# EAGLE design spool_tmc2130_b (EAGLE 9.7.0)
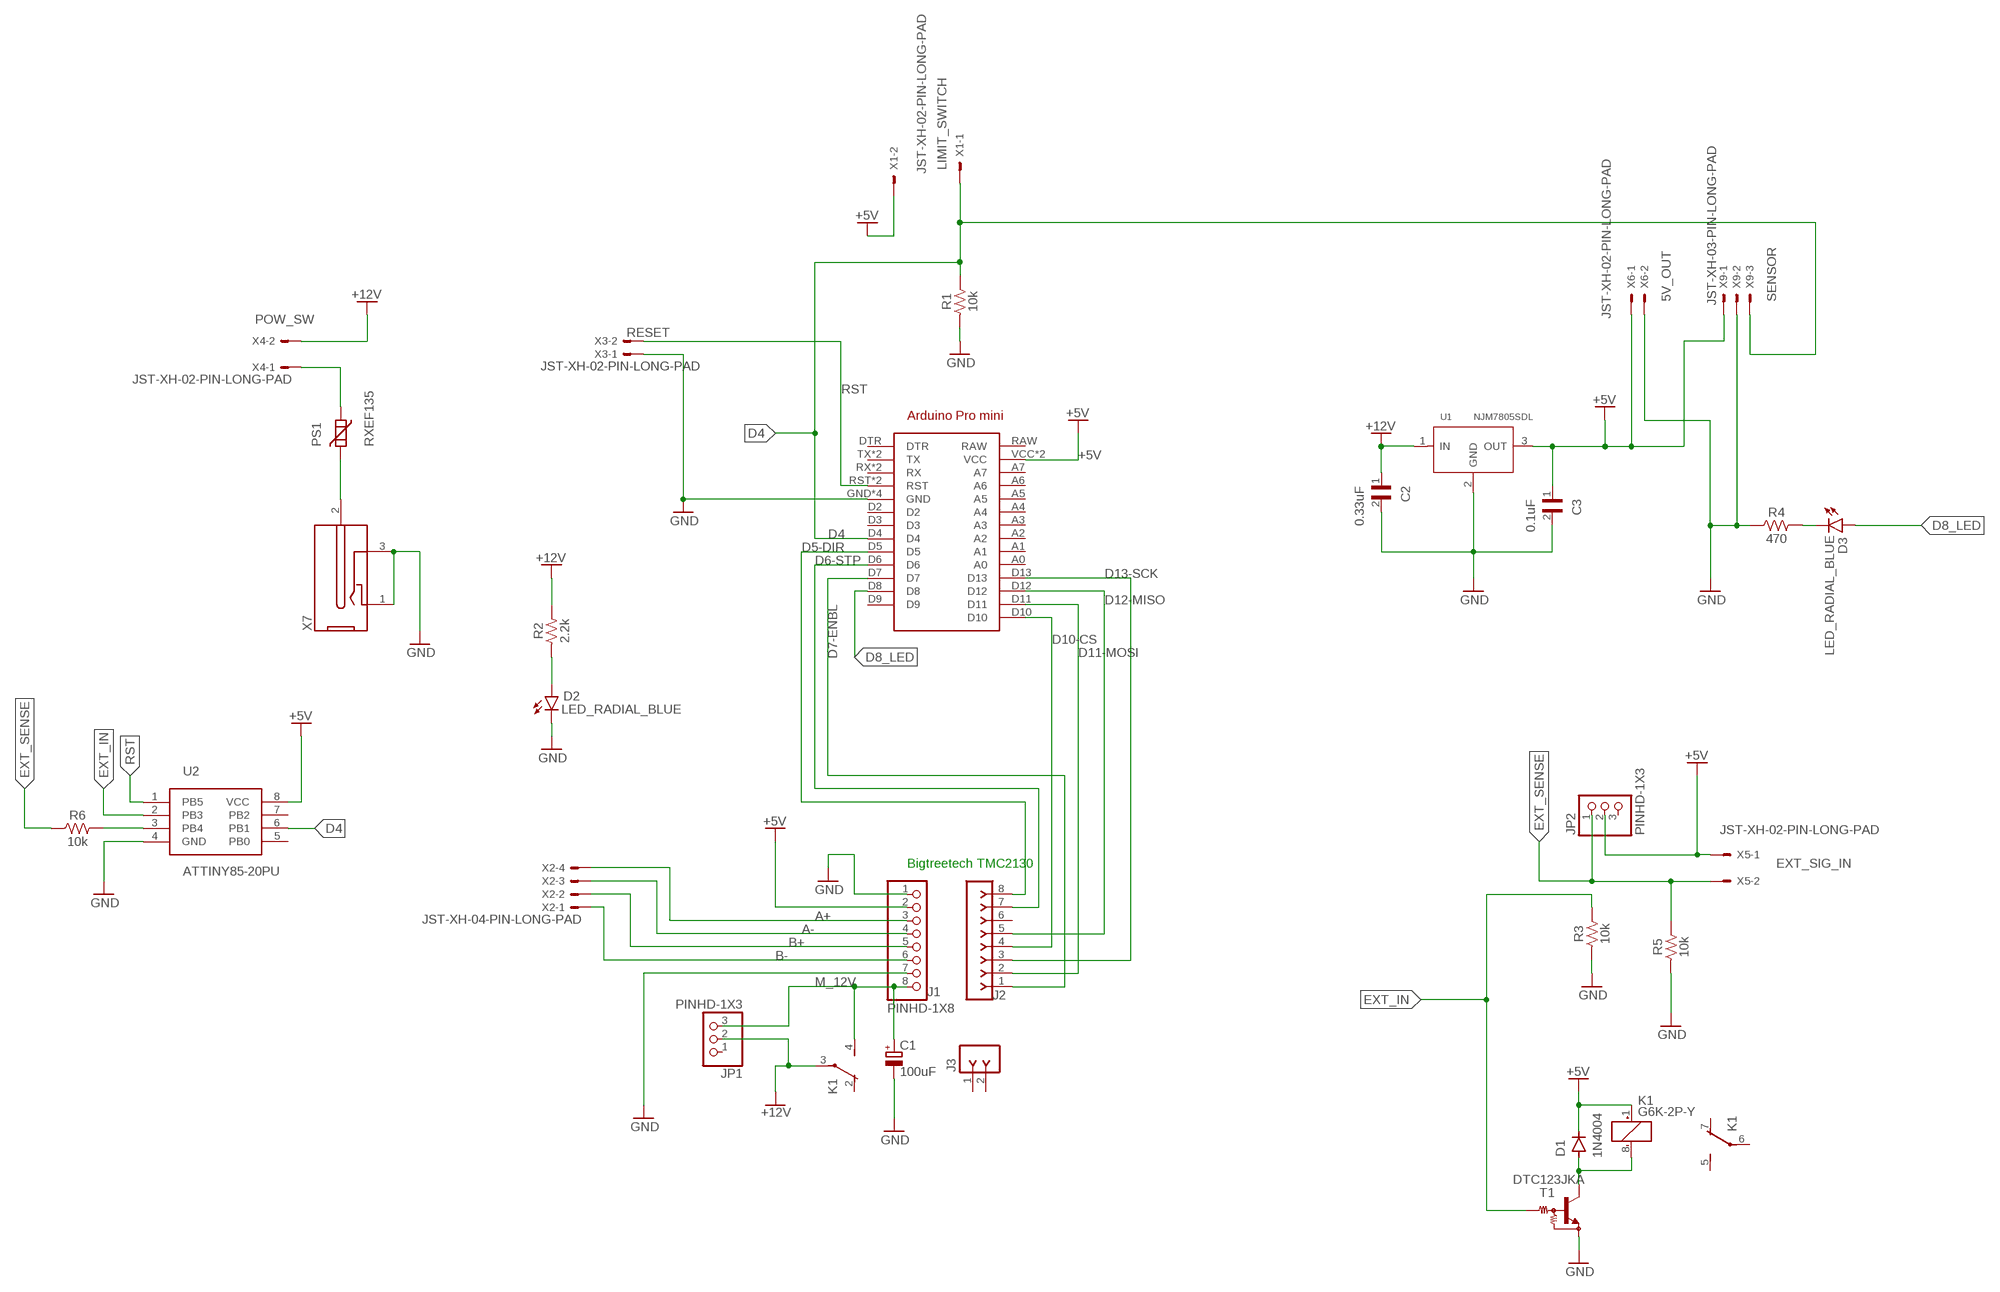
[diagram p0: schematic, sheet 1]

## Parts
ARDUINO1  ARDUINO_PRO_MINI  [ARDUINO_PRO_MINI]
C1  100uF  CPOL-EUE3.5-8  [E3,5-8]
C2  0.33uF  RDER73A103K2K1H03B  [CAP_RDER73A103K2K1H03B]
C3  0.1uF  RDER73A103K2K1H03B  [CAP_RDER73A103K2K1H03B]
D1  1N4004  [DO-41]
D2  LED_RADIAL_BLUE  [LEDRD254W60D565H860B_B]
D3  LED_RADIAL_BLUE  [LEDRD254W60D565H860B_B]
J1  PINHD-1X8  [1X08]
J2  F-1X08-SIP-100-40  [SIP-100-08-40]
J3  F-1X02-SIP-100-32  [SIP-100-02-32]
JP1  PINHD-1X3  [1X03]
JP2  PINHD-1X3  [1X03]
K1  G6K-2P-Y  [G6K-2P-Y]
PS1  RXEF135  POLYSWITCH5MM  [SO5K11]
R1  10k  R-US_CHIP-0805(2012-METRIC)  [RESC2012X65]
R2  2.2k  R-US_CHIP-0805(2012-METRIC)  [RESC2012X65]
R3  10k  R-US_CHIP-0805(2012-METRIC)  [RESC2012X65]
R4  470  R-US_CHIP-0805(2012-METRIC)  [RESC2012X65]
R5  10k  R-US_CHIP-0805(2012-METRIC)  [RESC2012X65]
R6  10k  R-US_CHIP-0805(2012-METRIC)  [RESC2012X65]
T1  DTC123JKA  MUN2211T1-NPN_DRIVER-SC59-BEC  [SC59-BEC]
U1  NJM7805SDL  PMIC-CJ78M05(TO-252)  [TO-252]
U2  ATTINY85-20PU  [PDIP-8]
X1  JST-XH-02-PIN-LONG-PAD  [JST-XH-02-PACKAGE-LONG-PAD]
X2  JST-XH-04-PIN-LONG-PAD  [JST-XH-04-PACKAGE-LONG-PAD]
X3  JST-XH-02-PIN-LONG-PAD  [JST-XH-02-PACKAGE-LONG-PAD]
X4  JST-XH-02-PIN-LONG-PAD  [JST-XH-02-PACKAGE-LONG-PAD]
X5  JST-XH-02-PIN-LONG-PAD  [JST-XH-02-PACKAGE-LONG-PAD]
X6  JST-XH-02-PIN-LONG-PAD  [JST-XH-02-PACKAGE-LONG-PAD]
X7  DC-2.1MM-5MM  [DC-21MM]
X9  JST-XH-03-PIN-LONG-PAD  [JST-XH-03-PACKAGE-LONG-PAD]

## Nets
+5V [5V]: ARDUINO1.VCC ARDUINO1.VCC@1(VCC) C3.1 D1.C J1.2 JP2.2 K1.1(1:+) U1.3(OUT) U2.8(VCC) X1.2 X5.1 X6.1 X9.1
+12V [vcc]: C2.1 JP1.2 K1.3(2:P) R2.2 U1.1(IN) X4.2
A+ [motor]: J1.3 X2.4
A- [motor]: J1.4 X2.3
B+ [motor]: J1.5 X2.2
B- [motor]: J1.6 X2.1
D4: ARDUINO1.D4 R1.2 U2.6(PB1) X1.1 X9.3
D5-DIR: ARDUINO1.D5 J2.8
D6-STP: ARDUINO1.D6 J2.7
D7-ENBL: ARDUINO1.D7 J2.1
D8_LED: ARDUINO1.D8 D3.1(A)
D10-CS: ARDUINO1.D10 J2.4
D11-MOSI: ARDUINO1.D11 J2.2
D12-MISO: ARDUINO1.D12 J2.5
D13-SCK: ARDUINO1.D13 J2.3
EXT_IN: R3.2 T1.B U2.2(PB3)
EXT_SENSE: JP2.1 R5.2 R6.1 X5.2
GND [GND]: ARDUINO1.GND ARDUINO1.GND@1(GND) ARDUINO1.GND@2(GND) ARDUINO1.GND@3(GND) C1.- C2.2 C3.2 D2.2(C) J1.1 J1.7 R1.1 R3.1 R4.1 R5.1 T1.E U1.2(GND) U2.4(GND) X3.1 X6.2 X7.1 X7.3 X9.2
M_12V [motor]: C1.+ J1.8 JP1.3 K1.4(2:S)
N$1: R6.2 U2.3(PB4)
N$2: D3.2(C) R4.2
N$9 [vcc]: PS1.1 X4.1
N$14 [vcc]: PS1.2 X7.2
N$16: D2.1(A) R2.1
N$18: D1.A K1.8(1:-) T1.C
RST: ARDUINO1.RST ARDUINO1.RST@1(RST) U2.1(PB5) X3.2
Unconnected: ARDUINO1.A0 ARDUINO1.A1 ARDUINO1.A2 ARDUINO1.A3 ARDUINO1.A4 ARDUINO1.A5 ARDUINO1.A6 ARDUINO1.A7 ARDUINO1.D2 ARDUINO1.D3 ARDUINO1.D9 ARDUINO1.DTR ARDUINO1.RAW ARDUINO1.RX ARDUINO1.RX@1(RX) ARDUINO1.TX ARDUINO1.TX@1(TX) J2.6 J3.1 J3.2 JP1.1 JP2.3 K1.2(2:O) K1.5(3:S) K1.6(3:P) K1.7(3:O) U2.5(PB0) U2.7(PB2)

## Notes on the sheet
- Bigtreetech TMC2130

## Library data of the parts
ARDUINO1 = arduinopromini:ARDUINO_PRO_MINI: For creating Arduino Pro Mini shields
C1 = resistor:CPOL-EU: POLARIZED CAPACITOR, European symbol
C2 C3 = RDER73A103K2K1H03B:RDER73A103K2K1H03B: Multilayer Ceramic Capacitors MLCC - Leaded Check availability <https://pricing.snapeda.com/parts/RDER73A103K2K1H03B/Murata/view-part?ref=eda>; AVAILABILITY: In Stock; DESCRIPTION: Lead capacitor X7R(EIA) with Capacitance 10000pF, Rated Voltage 1000Vdc; MF: Murata; MP: RDER73A103K2K1H03B; PACKAGE: NONSTANDARD; PRICE: None; PURCHASE-URL: https://pricing.snapeda.com/search/part/RDER73A103K2K1H03B/?ref=eda
D1 = Diodes:1N4004: DIODE GEN PURP 400V 1A DO41 Manufacturer's datasheet <https://www.mccsemi.com/pdf/Products/1N4001-1N4007(DO-41).pdf>; CREATED_BY: PCBLayout.com; DIGIKEY_PART_NUMBER: 1N4004MSCT-ND; MANUFACTURER: Micro Commercial Co; MPN: 1N4004; PACKAGE: DO-41
D2 D3 = Opto-Electronic:LED_RADIAL: LED - Generic; CATEGORY: Opto-Electronic; SUB-CATEGORY: LED
J1 = Connector:PINHD-1X8: PIN HEADER; CATEGORY: CONNECTOR; SUB-CATEGORY: PIN-HEADER
J2 = con-headers-jp:F-1X08-: FEMALE HEADER
J3 = con-headers-jp:F-1X02-: FEMALE HEADER
JP1 JP2 = Connector:PINHD-1X3: PIN HEADER; CATEGORY: CONNECTOR; SUB-CATEGORY: PIN-HEADER
K1 = relay:G6K: Low Signal Relay oeiwcsnts1.omron.com/.. D20G6K0100.pdf; MF: OMRON COMPONENTS USA; MPN: G6K-2P-Y DC12; OC_FARNELL: 3937276; OC_NEWARK: 34C3464
PS1 = my_mixed:POLYSWITCH
R1-R6 = Resistor:R-US: Resistor Fixed - ANSI; CATEGORY: Resistors; DESCRIPTION: Chip Resistor 2.00 X 1.25 X 0.65 mm body 0805(2012-METRIC) Package; PACKAGE_SIZE: 0805; PACKAGE_TYPE: Surface Mount
T1 = transistor-neu-to92:*-NPN_DRIVER-: NPN Bias Resistor Transistor
U1 = Seeed-IC_:PMIC-CJ78M05(TO-252): 310030100; MPN: CJ78M05; VALUE: CJ78M05-to252
U2 = Microcontroller:ATTINY85-20PU: IC MCU 8BIT 8KB FLASH 8DIP Manufacturer's datasheet <http://ww1.microchip.com/downloads/en/DeviceDoc/Atmel-2586-AVR-8-bit-Microcontroller-ATtiny25-ATtiny45-ATtiny85_Datasheet-Summary.pdf>; CREATED_BY: PCBLayout.com; DIGI_KEY_PART_NUMBER: ATTINY85-20PU-ND; MANUFACTURER: Microchip Technology; MPN: ATTINY85-20PU; PACKAGE: 8-PDIP
X1 = Rembrandt Electronics - JST XH Connectors v1-0:JST-XH-02-PIN: JST XH Connector 2 Pin Wire to board connector. Pitch: 2,54 mm, (0.100") Number of pins: 2 Created by Rembrandt Electronics www.rembrandtelectronics.com; LIMIT_SWITCH: LimitSwitch
X2 = Rembrandt Electronics - JST XH Connectors v1-0:JST-XH-04-PIN: JST XH Connector 2 Pin Wire to board connector. Pitch: 2,54 mm, (0.100") Number of pins: 4 Created by Rembrandt Electronics www.rembrandtelectronics.com
X3 = Rembrandt Electronics - JST XH Connectors v1-0:JST-XH-02-PIN: JST XH Connector 2 Pin Wire to board connector. Pitch: 2,54 mm, (0.100") Number of pins: 2 Created by Rembrandt Electronics www.rembrandtelectronics.com; RESET: RESET
X4 = Rembrandt Electronics - JST XH Connectors v1-0:JST-XH-02-PIN: JST XH Connector 2 Pin Wire to board connector. Pitch: 2,54 mm, (0.100") Number of pins: 2 Created by Rembrandt Electronics www.rembrandtelectronics.com; POW_SW: POW_SW
X5 = Rembrandt Electronics - JST XH Connectors v1-0:JST-XH-02-PIN: JST XH Connector 2 Pin Wire to board connector. Pitch: 2,54 mm, (0.100") Number of pins: 2 Created by Rembrandt Electronics www.rembrandtelectronics.com; EXT_SIG_IN: EXT_SIG_IN
X6 = Rembrandt Electronics - JST XH Connectors v1-0:JST-XH-02-PIN: JST XH Connector 2 Pin Wire to board connector. Pitch: 2,54 mm, (0.100") Number of pins: 2 Created by Rembrandt Electronics www.rembrandtelectronics.com; 5V_OUT: 5V_out
X7 = power-jack:DC: 5mm x 2.1mm jack
X9 = Rembrandt Electronics - JST XH Connectors v1-0:JST-XH-03-PIN: JST XH Connector 2 Pin Wire to board connector. Pitch: 2,54 mm, (0.100") Number of pins: 3 Created by Rembrandt Electronics www.rembrandtelectronics.com

## Net classes
0 default: width 0.203 mm, clearance 0.254 mm
1 vcc: width 0.8 mm, clearance 0.381 mm
2 motor: width 1.27 mm, clearance 0.381 mm
3 GND: width 1.524 mm, clearance 0.254 mm
4 5V: width 0.762 mm, clearance 0.254 mm

## Board
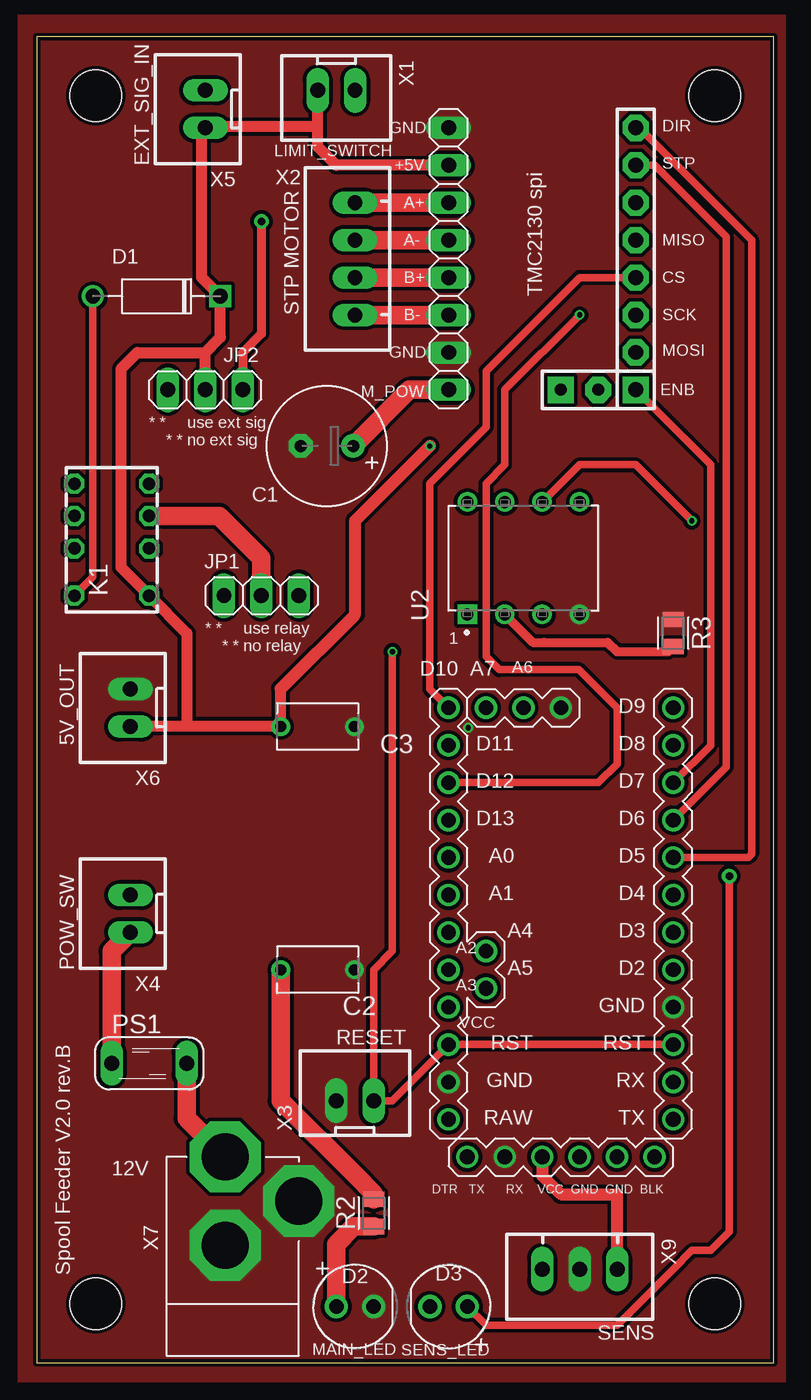
[diagram p1: board, top side]
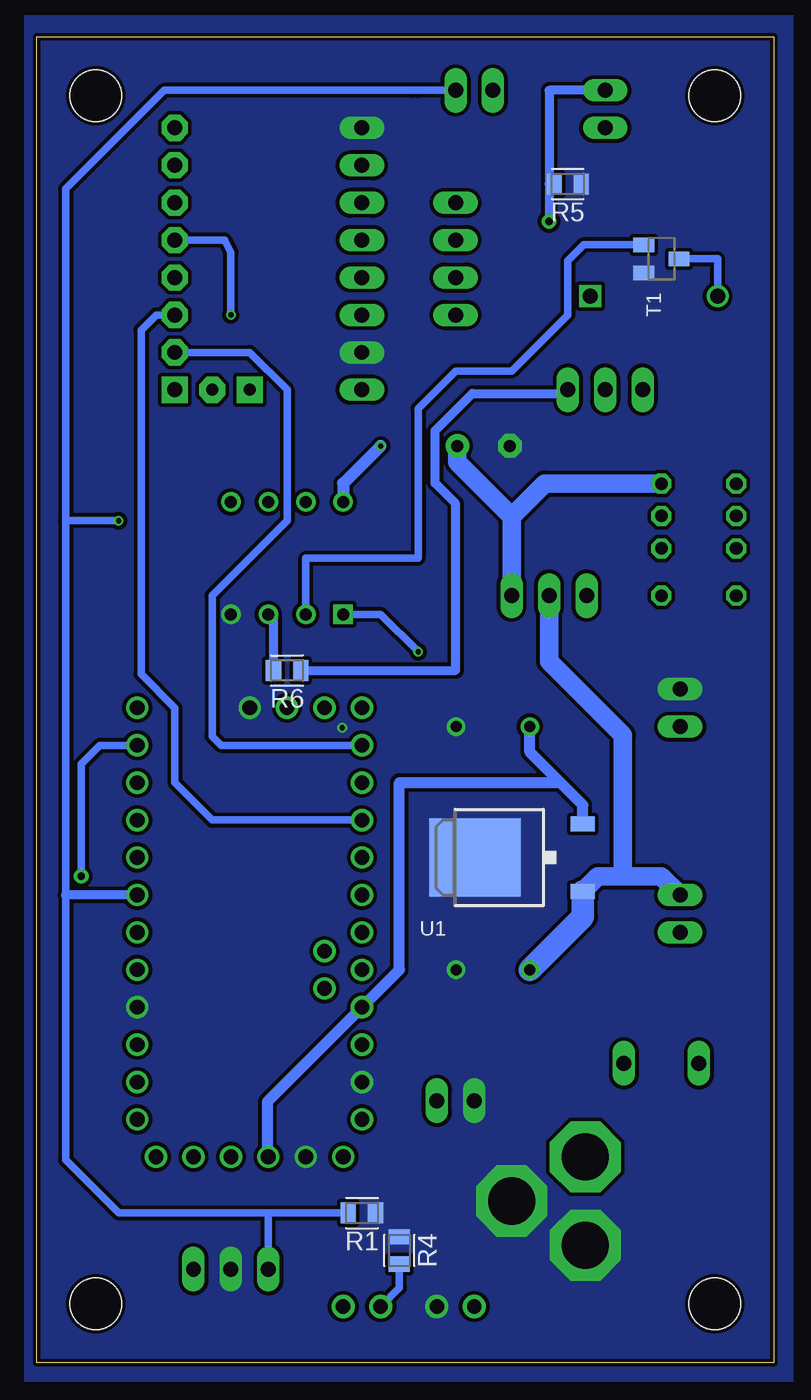
[diagram p2: board, bottom side, seen from below]

Size 50 x 90 mm. Coordinates in mm from the lower left corner, seen from the top.
Outline: 0,90 0,0 50,0 50,90 0,90
Copper layers (1*16): Top 0.035mm / dielectric 1.5mm / Bottom 0.035mm
Design rules "SeeedStudio_2layer_DRU_no_angle_20140221": minimum track width 6mil, minimum drill 12mil, track to track 6mil, track to pad 6mil, pad to pad 6mil, via to via 6mil, smd to smd 0mil, copper to edge 10mil, drill to drill 10mil, minimum pad ring 10mil, minimum via ring 6mil, stop-mask expansion 2mil, vias tented up to drill 100mil, thermal gap 10mil
Holes 3.5 mm at 4,86 46,86 46,4 4,4

### Footprints (pad centres in the part's own frame; a part is rotated, then mirrored left to right if it is on the bottom)
ARDUINO_PRO_MINI = drill 1: A0 11.43,-8.89; A1 11.43,-6.35; A2 11.43,-3.81; A3 11.43,-1.27; A4 8.89,-2.54; A5 8.89,0; A6 6.35,-19.05; A7 8.89,-19.05; BLK 10.16,11.43; D2 -3.81,-1.27; D3 -3.81,-3.81; D4 -3.81,-6.35; D5 -3.81,-8.89; D6 -3.81,-11.43; D7 -3.81,-13.97; D8 -3.81,-16.51; D9 -3.81,-19.05; D10 11.43,-19.05; D11 11.43,-16.51; D12 11.43,-13.97; D13 11.43,-11.43; DTR -2.54,11.43; GND -3.81,1.27; GND@1 11.43,6.35; GND@2 7.62,11.43; GND@3 3.81,-19.05; RAW 11.43,8.89; RST 11.43,3.81; RST@1 -3.81,3.81; RX -3.81,6.35; RX@1 2.54,11.43; TX -3.81,8.89; TX@1 0,11.43; VCC 11.43,1.27; VCC@1 5.08,11.43
E3,5-8 = drill 0.813 pad 1.6: + -1.778,0 | drill 0.813 pad 1.6 octagon: - 1.778,0
CAP_RDER73A103K2K1H03B = drill 0.75 pad 1.15: 1 -2.5,0; 2 2.5,0
DO-41 = drill 1: A 4.325,0 | drill 1 square: C -4.325,0
LEDRD254W60D565H860B_B = drill 0.981 pad 1.581: 1 -1.27,0; 2 1.27,0
1X08 = drill 1.016 long: 1 -8.89,0; 2 -6.35,0; 3 -3.81,0; 4 -1.27,0; 5 1.27,0; 6 3.81,0; 7 6.35,0; 8 8.89,0
SIP-100-08-40 = drill 1.016 pad 1.778 square: 1 -8.89,0 | drill 1.016 pad 1.778 octagon: 2 -6.35,0; 3 -3.81,0; 4 -1.27,0; 5 1.27,0; 6 3.81,0; 7 6.35,0; 8 8.89,0
SIP-100-02-32 = drill 0.813 pad 1.778 square: 1 -1.27,0 | drill 0.813 pad 1.778 octagon: 2 1.27,0
1X03 = drill 1.016 long: 1 -2.54,0; 2 0,0; 3 2.54,0
G6K-2P-Y = drill 0.85 octagon: 1 0,-2.54; 2 3.2,-2.54; 3 5.4,-2.54; 4 7.6,-2.54; 5 7.6,2.54; 6 5.4,2.54; 7 3.2,2.54; 8 0,2.54
SO5K11 = drill 1.016 pad 1.422 long: 1 0,-2.54; 2 0,2.54
RESC2012X65 = smd 1.031 x 1.42: 1 -0.919,0; 2 0.919,0
SC59-BEC = smd 1 x 1.4: B -0.95,-1.2; C 0,1.2; E 0.95,-1.2
TO-252 = smd 1.016 x 1.651: 1 -2.286,-4.826; 3 2.286,-4.826 | smd 5.3 x 6.2: 2 0,2.5
PDIP-8 = drill 0.813 pad 1.219 square: 1 -3.81,3.81 | drill 0.813 pad 1.219: 2 -3.81,1.27; 3 -3.81,-1.27; 4 -3.81,-3.81; 5 3.81,-3.81; 6 3.81,-1.27; 7 3.81,1.27; 8 3.81,3.81
JST-XH-02-PACKAGE-LONG-PAD = drill 1.016 long: 1 -1.27,0; 2 1.27,0
JST-XH-04-PACKAGE-LONG-PAD = drill 1.016 long: 1 -3.81,0; 2 -1.27,0; 3 1.27,0; 4 3.81,0
DC-21MM = drill 3.2 pad 4.826 octagon: 1 -5.08,-3.353; 2 -0.076,-6.35; 3 -0.076,-0.356
JST-XH-03-PACKAGE-LONG-PAD = drill 1.016 long: 1 -2.54,0; 2 0,0; 3 2.54,0

### Placement (x,y rotation side)
ARDUINO1  39.37,25.4 180 top
C1  19.68,62.23 180 top
C2  19.05,26.67 0 top
C3  19.05,43.18 0 top
D1  8.13,72.39 180 top
D2  21.59,3.81 0 top
D3  27.94,3.81 180 top
J1  27.94,74.93 270 top
J2  40.64,74.93 90 top
J3  36.83,66.04 0 top
JP1  15.24,52.07 0 top
JP2  11.43,66.04 180 top
K1  5.08,52.07 90 top
PS1  7.62,20.32 270 top
R1  27.94,10.16 180 bottom
R2  22.86,10.16 90 top
R3  43.18,49.53 270 top
R4  25.4,7.62 270 bottom
R5  13.97,80.01 180 bottom
R6  33.02,46.99 180 bottom
T1  7.62,74.93 270 bottom
U1  17.78,34.29 90 bottom
U2  33.02,54.61 90 top
X1  20.32,86.36 180 top
X2  21.59,74.93 90 top
X3  21.59,17.78 0 top
X4  6.35,30.48 90 top
X5  11.43,85.09 90 top
X6  6.35,44.45 90 top
X7  12.7,7.62 180 top
X9  36.83,6.35 180 top

### Tracks (layer width: path | path; a pad name or v marks a point on that pad's centre or on a via)
+5V  (via drill 0.35)
  Top 0.762: 19.05,83.91 11.52,83.91 X5.1 11.18,83.57 11.18,73.66 D1.C 12.45,69.6 11.43,68.58 | J1.2 20.32,81.28 19.05,82.55 19.05,83.91 | 6.4,43.2 9.97,43.2 | 9.97,43.2 10.18,43.41 10.18,49.51 K1.1 5.71,53.98 5.71,67.47 6.82,68.58 11.43,68.58 | 19.05,83.91 X1.2 | JP2.2 11.43,68.58 | 16.55,45.76 C3.1 16.52,43.2 9.97,43.2
  Top 0.813: ARDUINO1.VCC@1 34.29,12.7 35.56,11.43 39.37,11.43 X9.1 | 16.55,45.76 21.59,50.8 21.59,57.15 v26.67,62.23 | X6.1 6.38,43.2 6.4,43.2
  Bottom 0.762: ARDUINO1.VCC@1 34.35,14.03 34.35,17.72 ARDUINO1.VCC 25.4,26.67 25.4,39.37 14.48,39.37 | 14.48,39.37 16.55,41.44 C3.1 | 14.48,39.37 12.95,37.85 U1.3
  Bottom 0.813: v26.67,62.23 29.21,59.69 U2.8
+12V
  Top 1.27: JP1.2 15.24,54.61 12.38,57.47 K1.3 | C2.1 16.55,17.78 21.59,12.74 22.86,11.47 R2.2
  Bottom 1.27: U1.1 11.94,33.02 10.24,33.02 | JP1.2 15.24,47.6 10.24,42.6 10.24,33.02 | X4.2 7.62,33.02 10.24,33.02
  Bottom 1.524: U1.1 12.95,30.27 C2.1
A+
  Top 1.27: J1.3 X2.4
A-
  Top 1.27: J1.4 X2.3
B+
  Top 1.27: J1.5 X2.2
B-
  Top 1.27: J1.6 X2.1
D4  (via drill 0.35)
  Top 0.508: U2.6 36.83,60.96 40.64,60.96 v44.45,57.15
  Bottom 0.508: 48.04,57.15 48.04,79.69 41.37,86.36 24.55,86.36 24.13,86.36 X1.1 | 48.04,57.15 48.04,31.75 48.04,13.75 44.45,10.16 34.29,10.16 | 34.29,10.16 33.02,10.16 30.48,10.16 R1.2 | X9.3 34.29,10.16 | v44.45,57.15 48.04,57.15
  Bottom 0.61: ARDUINO1.D4 48.04,31.75
D5-DIR
  Top 0.508: ARDUINO1.D5 43.19,34.3 48.26,34.3 48.5,34.54 48.5,76.2 40.88,83.82 J2.8
D6-STP
  Top 0.508: ARDUINO1.D6 46.77,40.42 46.77,76.44 41.93,81.28 J2.7
D7-ENBL
  Top 0.508: ARDUINO1.D7 45.72,41.91 45.72,60.96 J2.1
D8_LED  (via drill 0.5 pad 1)
  Top 0.508: v46.99,33.02 46.99,8.89 45.72,7.62 44.45,7.62 43.18,6.35 39.37,2.54 30.48,2.54 D3.1
  Bottom 0.508: ARDUINO1.D8 45.72,41.91 46.99,40.64 v46.99,33.02
D10-CS
  Top 0.508: J2.4 36.83,73.66 30.48,67.31 30.48,63.5 26.67,59.69 26.67,45.72 ARDUINO1.D10
D11-MOSI
  Bottom 0.508: ARDUINO1.D11 37.5,41.91 38.1,42.51 38.1,52.07 33.02,57.15 33.02,66.04 35.56,68.58 J2.2
D12-MISO  (via drill 0.35)
  Top 0.508: ARDUINO1.D12 38.1,39.37 39.38,40.65 39.38,44.45 39.37,44.45 36.78,47.04 31.37,47.04 30.48,47.94 30.48,59.69 31.75,60.96 31.75,66.04 v36.83,71.12
  Bottom 0.508: v36.83,71.12 36.83,75.35 37.25,76.2 J2.5
D13-SCK
  Bottom 0.508: ARDUINO1.D13 38.1,36.83 40.64,39.37 40.64,44.45 42.93,46.74 42.93,70.1 41.91,71.12 J2.3
EXT_IN
  Top 0.61: U2.2 33.66,48.9 34.42,48.9 38.73,48.9 39.37,48.26 42.83,48.26 R3.2
  Bottom 0.508: T1.B 12.89,75.88 13.97,74.81 13.97,71.12 17.78,67.31 21.59,67.31 24.13,64.77 24.13,54.61 31.75,54.61 U2.2
EXT_SENSE  (via drill 0.5 pad 1)
  Top 0.61: v15.24,77.47 15.24,69.85 13.97,68.58 JP2.1
  Bottom 0.61: X5.2 15.24,86.36 15.24,80.01 | 15.24,80.01 v15.24,77.47 | R6.1 21.59,46.99 21.59,48.26 21.59,58.31 22.97,59.7 22.97,63.26 20.45,65.79 14.22,65.79 JP2.1 | R5.2 15.24,80.01
GND  (via drill 0.35)
  other vias: 29.27,43.1
  pour Top (no thermals): -1.27,-1.27 50.8,-1.27 50.8,91.44 -1.27,91.44
  pour Bottom (no thermals): -1.27,-1.27 50.8,-1.27 50.8,91.44 -1.27,91.44
M_12V
  Top 1.27: J1.8 25.27,66.04 C1.+
  Bottom 1.27: 17.78,57.44 15.53,59.69 7.64,59.69 K1.4 | C1.+ 21.46,61.12 17.78,57.44 | JP1.3 17.78,57.44
N$1
  Bottom 0.61: R6.2 33.94,50.45 U2.3
N$2
  Bottom 0.508: D3.2 25.4,5.08 R4.2
N$9
  Top 1.27: PS1.1 5.08,27.94 X4.1
N$14
  Top 1.27: PS1.2 10.16,16.59 X7.2
N$16
  Top 1.27: D2.1 20.32,8.04 21.52,9.24 R2.1
N$18
  Top 0.508: D1.A 3.8,72.17 3.79,72.15 3.79,53.31 K1.8
  Bottom 0.508: T1.C 3.81,74.93 D1.A
RST  (via drill 0.35)
  Top 0.508: ARDUINO1.RST@1 ARDUINO1.RST 24.13,17.78 X3.2 22.86,26.67 24.13,27.94 v24.13,48.26
  Bottom 0.508: v24.13,48.26 26.67,50.8 U2.1

### Text on the board
tNames: DIR | GND | +5V | STP | A+ | A- | MISO | B+ | CS | TMC2130 spi | STP MOTOR | B- | SCK | GND | MOSI | M_POW | ENB | * * □ use ext sig / □ * * no ext sig | 1 | * * □ use relay / □ * * no relay | Spool Feeder V2.0 rev.B | 12V